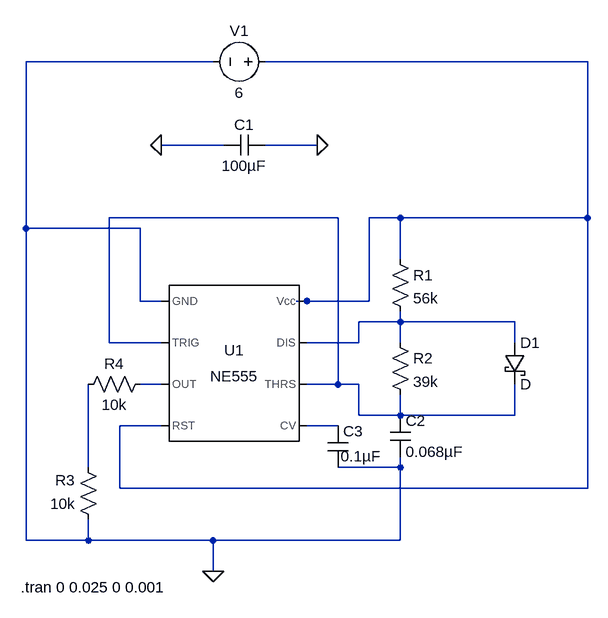
[diagram p0: schematic NE555 multivibrator+.asc]
NE555 multivibrator+.asc, the LTspice schematic file:
Version 4
SHEET 1 924 680
WIRE 208 -224 -80 -224
WIRE 784 -224 288 -224
WIRE 224 -96 128 -96
WIRE 368 -96 288 -96
WIRE 400 16 48 16
WIRE 496 16 448 16
WIRE 784 16 784 -224
WIRE 784 16 496 16
WIRE -80 32 -80 -224
WIRE 96 32 -80 32
WIRE 496 80 496 16
WIRE 96 144 96 32
WIRE 128 144 96 144
WIRE 352 144 336 144
WIRE 448 144 448 16
WIRE 448 144 352 144
WIRE 496 176 496 160
WIRE 496 176 432 176
WIRE 672 176 496 176
WIRE 48 208 48 16
WIRE 128 208 48 208
WIRE 432 208 432 176
WIRE 432 208 352 208
WIRE 496 208 496 176
WIRE 672 208 672 176
WIRE 128 272 96 272
WIRE 400 272 400 16
WIRE 400 272 352 272
WIRE 432 272 400 272
WIRE 432 320 432 272
WIRE 496 320 496 288
WIRE 496 320 432 320
WIRE 672 320 672 272
WIRE 672 320 496 320
WIRE 128 336 64 336
WIRE 400 336 352 336
WIRE 16 400 16 272
WIRE 496 400 496 384
WIRE 496 400 400 400
WIRE 64 432 64 336
WIRE 784 432 784 16
WIRE 784 432 64 432
WIRE -80 512 -80 32
WIRE 16 512 16 480
WIRE 16 512 -80 512
WIRE 208 512 16 512
WIRE 496 512 496 400
WIRE 496 512 208 512
WIRE 208 560 208 512
FLAG 208 560 0
FLAG 368 -96 0
FLAG 128 -96 0
SYMBOL Misc\\NE555 240 240 R0
SYMATTR InstName U1
SYMBOL cap 288 -112 R90
WINDOW 0 0 32 VBottom 2
WINDOW 3 32 32 VTop 2
SYMATTR InstName C1
SYMATTR Value 100µF
SYMATTR SpiceLine V=25
SYMBOL cap 480 320 R0
SYMATTR InstName C2
SYMATTR Value 0.068µF
SYMATTR SpiceLine V=25
SYMBOL res 32 496 R180
WINDOW 0 36 76 Left 2
WINDOW 3 36 40 Left 2
SYMATTR InstName R3
SYMATTR Value 10k
SYMATTR SpiceLine tol=5
SYMBOL res 480 192 R0
SYMATTR InstName R2
SYMATTR Value 39k
SYMATTR SpiceLine tol=5
SYMBOL voltage 304 -224 R90
WINDOW 0 -32 56 VBottom 2
WINDOW 3 32 56 VTop 2
WINDOW 123 0 0 Left 0
WINDOW 39 0 0 Left 0
SYMATTR InstName V1
SYMATTR Value 6
SYMBOL cap 384 336 R0
WINDOW 3 20 47 Left 2
SYMATTR Value 0.1µF
SYMATTR InstName C3
SYMBOL res 480 64 R0
SYMATTR InstName R1
SYMATTR Value 56k
SYMATTR SpiceLine tol=5
SYMBOL res 112 256 R90
WINDOW 0 0 56 VBottom 2
WINDOW 3 32 56 VTop 2
SYMATTR InstName R4
SYMATTR Value 10k
SYMATTR SpiceLine tol=5
SYMBOL schottky 656 208 R0
SYMATTR InstName D1
TEXT -88 584 Left 2 !.tran 0 0.025 0 0.001

The netlist it stands for:
* NE555 multivibrator+.asc
XU1 0 N002 N004 N001 N005 N002 N003 N001 NE555  ; pins GND TRIG OUT RST CV THRS DIS Vcc
C1 0 0 100µF V=25
C2 N002 0 0.068µF V=25
R3 0 N006 10k tol=5
R2 N003 N002 39k tol=5
V1 N001 0 6
C3 N005 0 0.1µF
R1 N001 N003 56k tol=5
R4 N004 N006 10k tol=5
D1 N003 N002 D
.model D D
.lib standard.dio
.tran 0 0.025 0 0.001
.lib NE555.sub
.backanno
.end